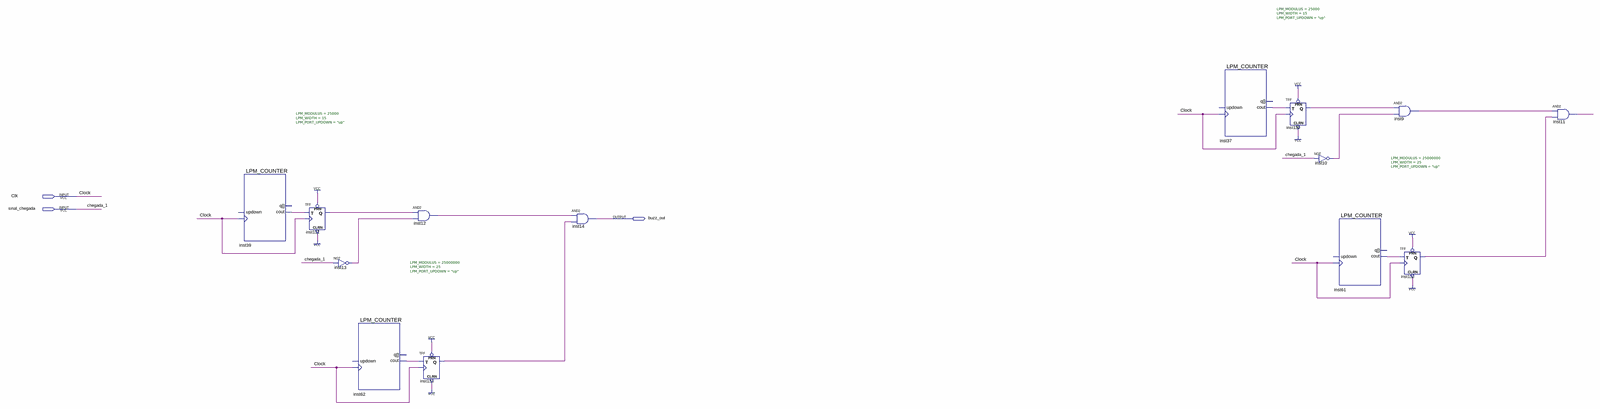
[diagram p0: schematic sheet, whole]
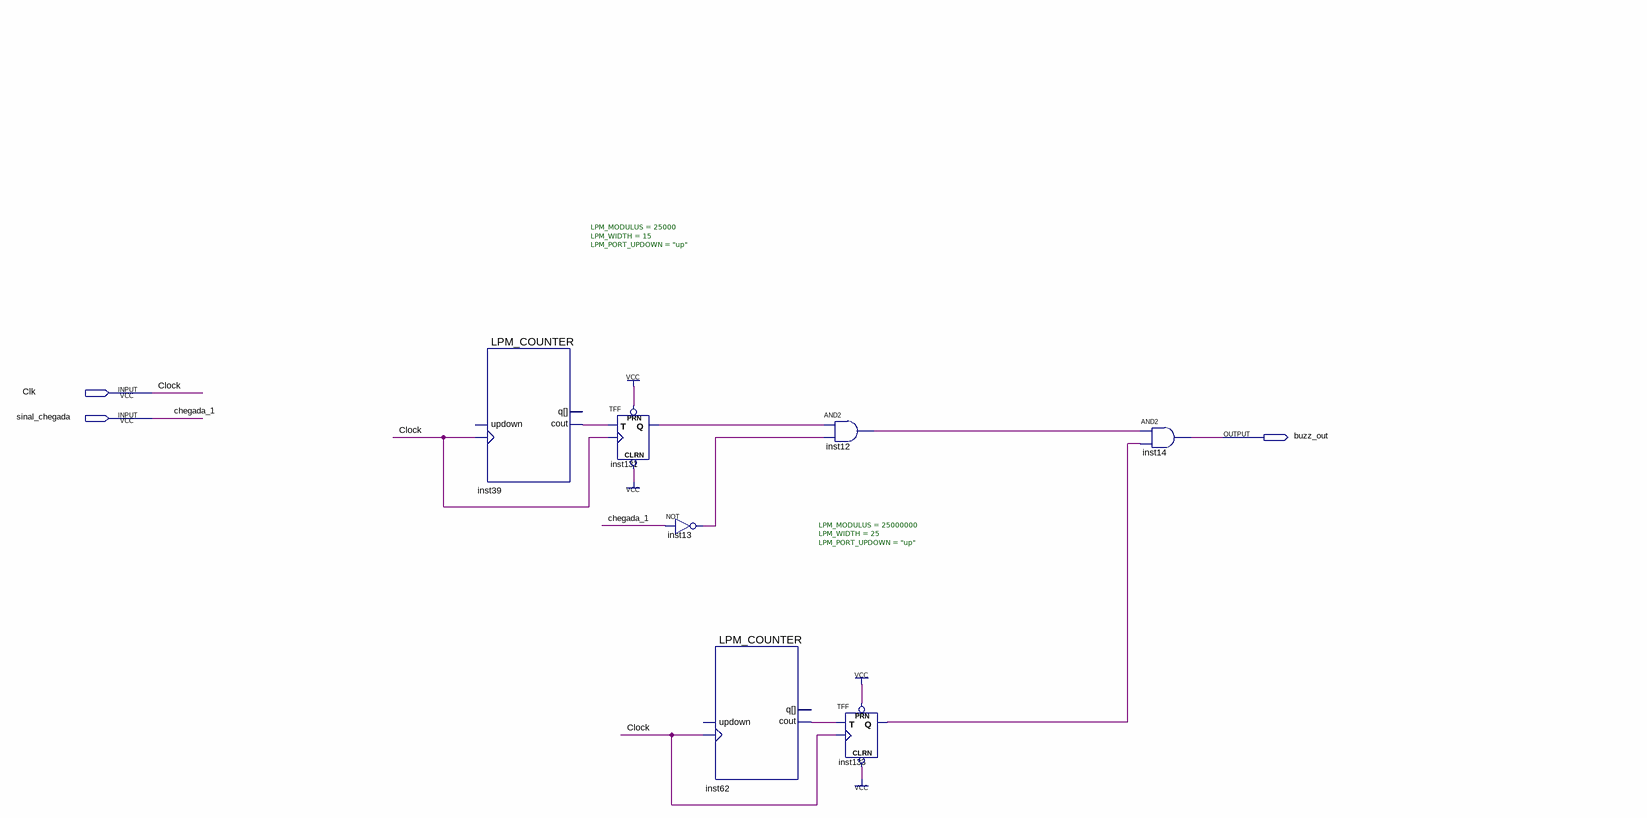
[diagram p1: schematic sheet, left part]
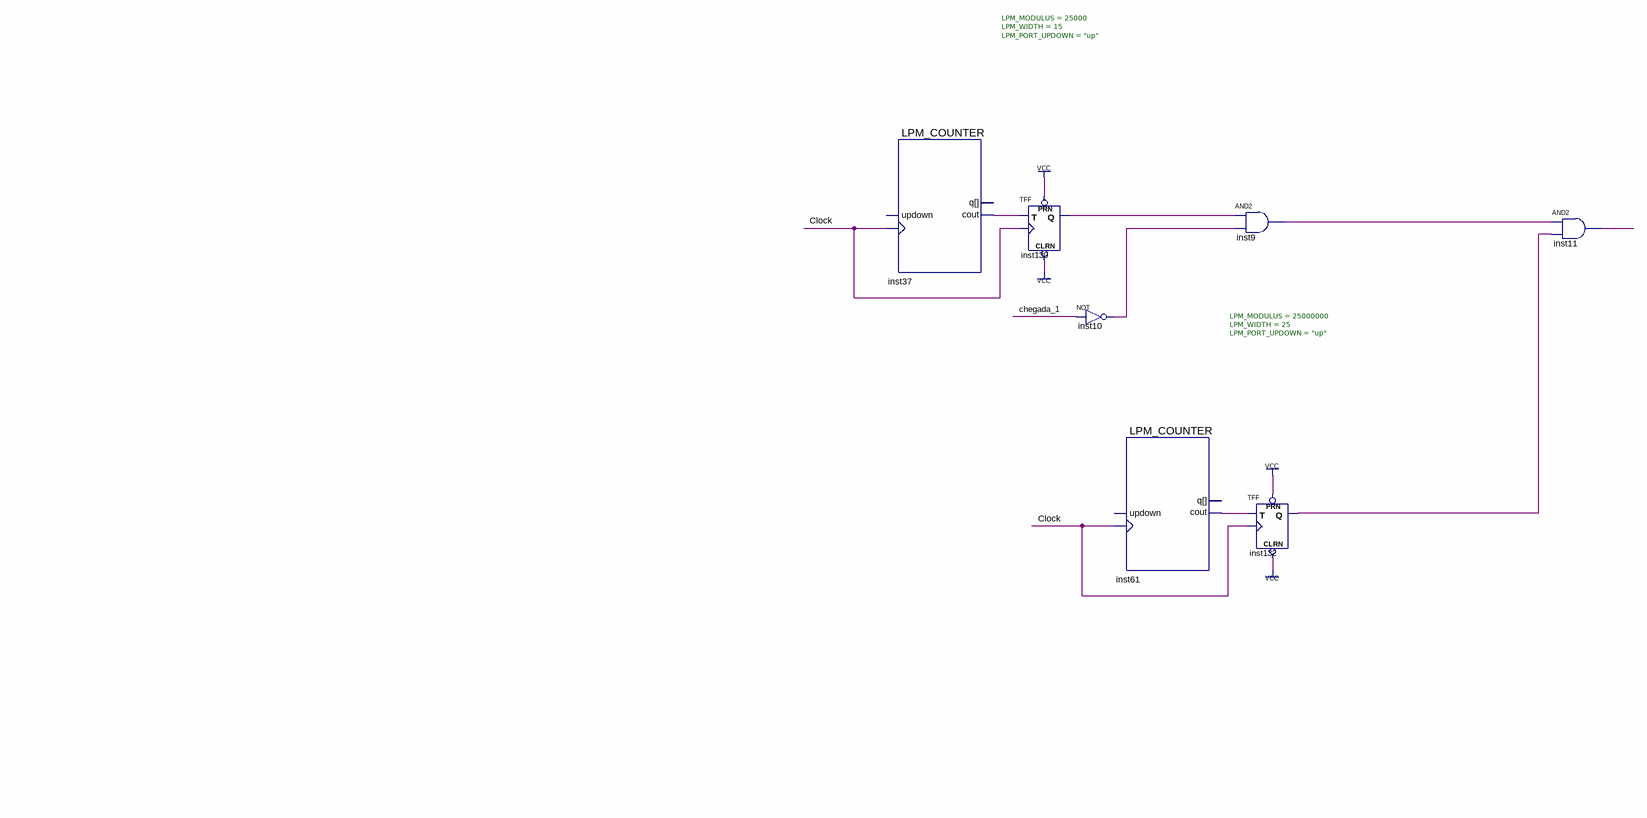
[diagram p2: schematic sheet, right part]
// Quartus schematic alarme1.bdf as structural Verilog: 14 symbols, 3 pins
module alarme1 (
  input  Clk,
  input  sinal_chegada,
  output buzz_out
);

  wire inst9_out, inst10_out, inst11_out, inst12_out, inst13_out, inst37_cout, inst39_cout, inst61_cout,
       inst62_cout, inst130_q, inst131_q, inst132_q, inst133_q;

  LPM_COUNTER #(.LPM_MODULUS(25000), .LPM_WIDTH(15), .LPM_PORT_UPDOWN("up")) inst39 (
    .clock(Clk), .cout(inst39_cout));  // open: updown, q
  TFF inst131 (.PRN(1'b1), .CLRN(1'b1), .T(inst39_cout), .CLK(Clk), .Q(inst131_q));
  not inst13 (inst13_out, sinal_chegada);
  LPM_COUNTER #(.LPM_MODULUS(25000000), .LPM_WIDTH(25), .LPM_PORT_UPDOWN("up")) inst62 (
    .clock(Clk), .cout(inst62_cout));  // open: updown, q
  and inst12 (inst12_out, inst131_q, inst13_out);
  TFF inst133 (.PRN(1'b1), .CLRN(1'b1), .T(inst62_cout), .CLK(Clk), .Q(inst133_q));
  and inst14 (buzz_out, inst12_out, inst133_q);
  LPM_COUNTER #(.LPM_MODULUS(25000), .LPM_WIDTH(15), .LPM_PORT_UPDOWN("up")) inst37 (
    .clock(Clk), .cout(inst37_cout));  // open: updown, q
  TFF inst130 (.PRN(1'b1), .CLRN(1'b1), .T(inst37_cout), .CLK(Clk), .Q(inst130_q));
  not inst10 (inst10_out, sinal_chegada);
  LPM_COUNTER #(.LPM_MODULUS(25000000), .LPM_WIDTH(25), .LPM_PORT_UPDOWN("up")) inst61 (
    .clock(Clk), .cout(inst61_cout));  // open: updown, q
  and inst9 (inst9_out, inst130_q, inst10_out);
  TFF inst132 (.PRN(1'b1), .CLRN(1'b1), .T(inst61_cout), .CLK(Clk), .Q(inst132_q));
  and inst11 (inst11_out, inst9_out, inst132_q);

  // Other names for the same wires on the sheet: chegada_1 = sinal_chegada; Clock = Clk
endmodule
